# Altium schematic sheet Ethernet Interface.SchDoc (part 1 of 3)
size 594 x 420 mm; Author: ALTIUM GOSTBOM2.0 KEV; SheetNumber: 12; SheetTotal: 48
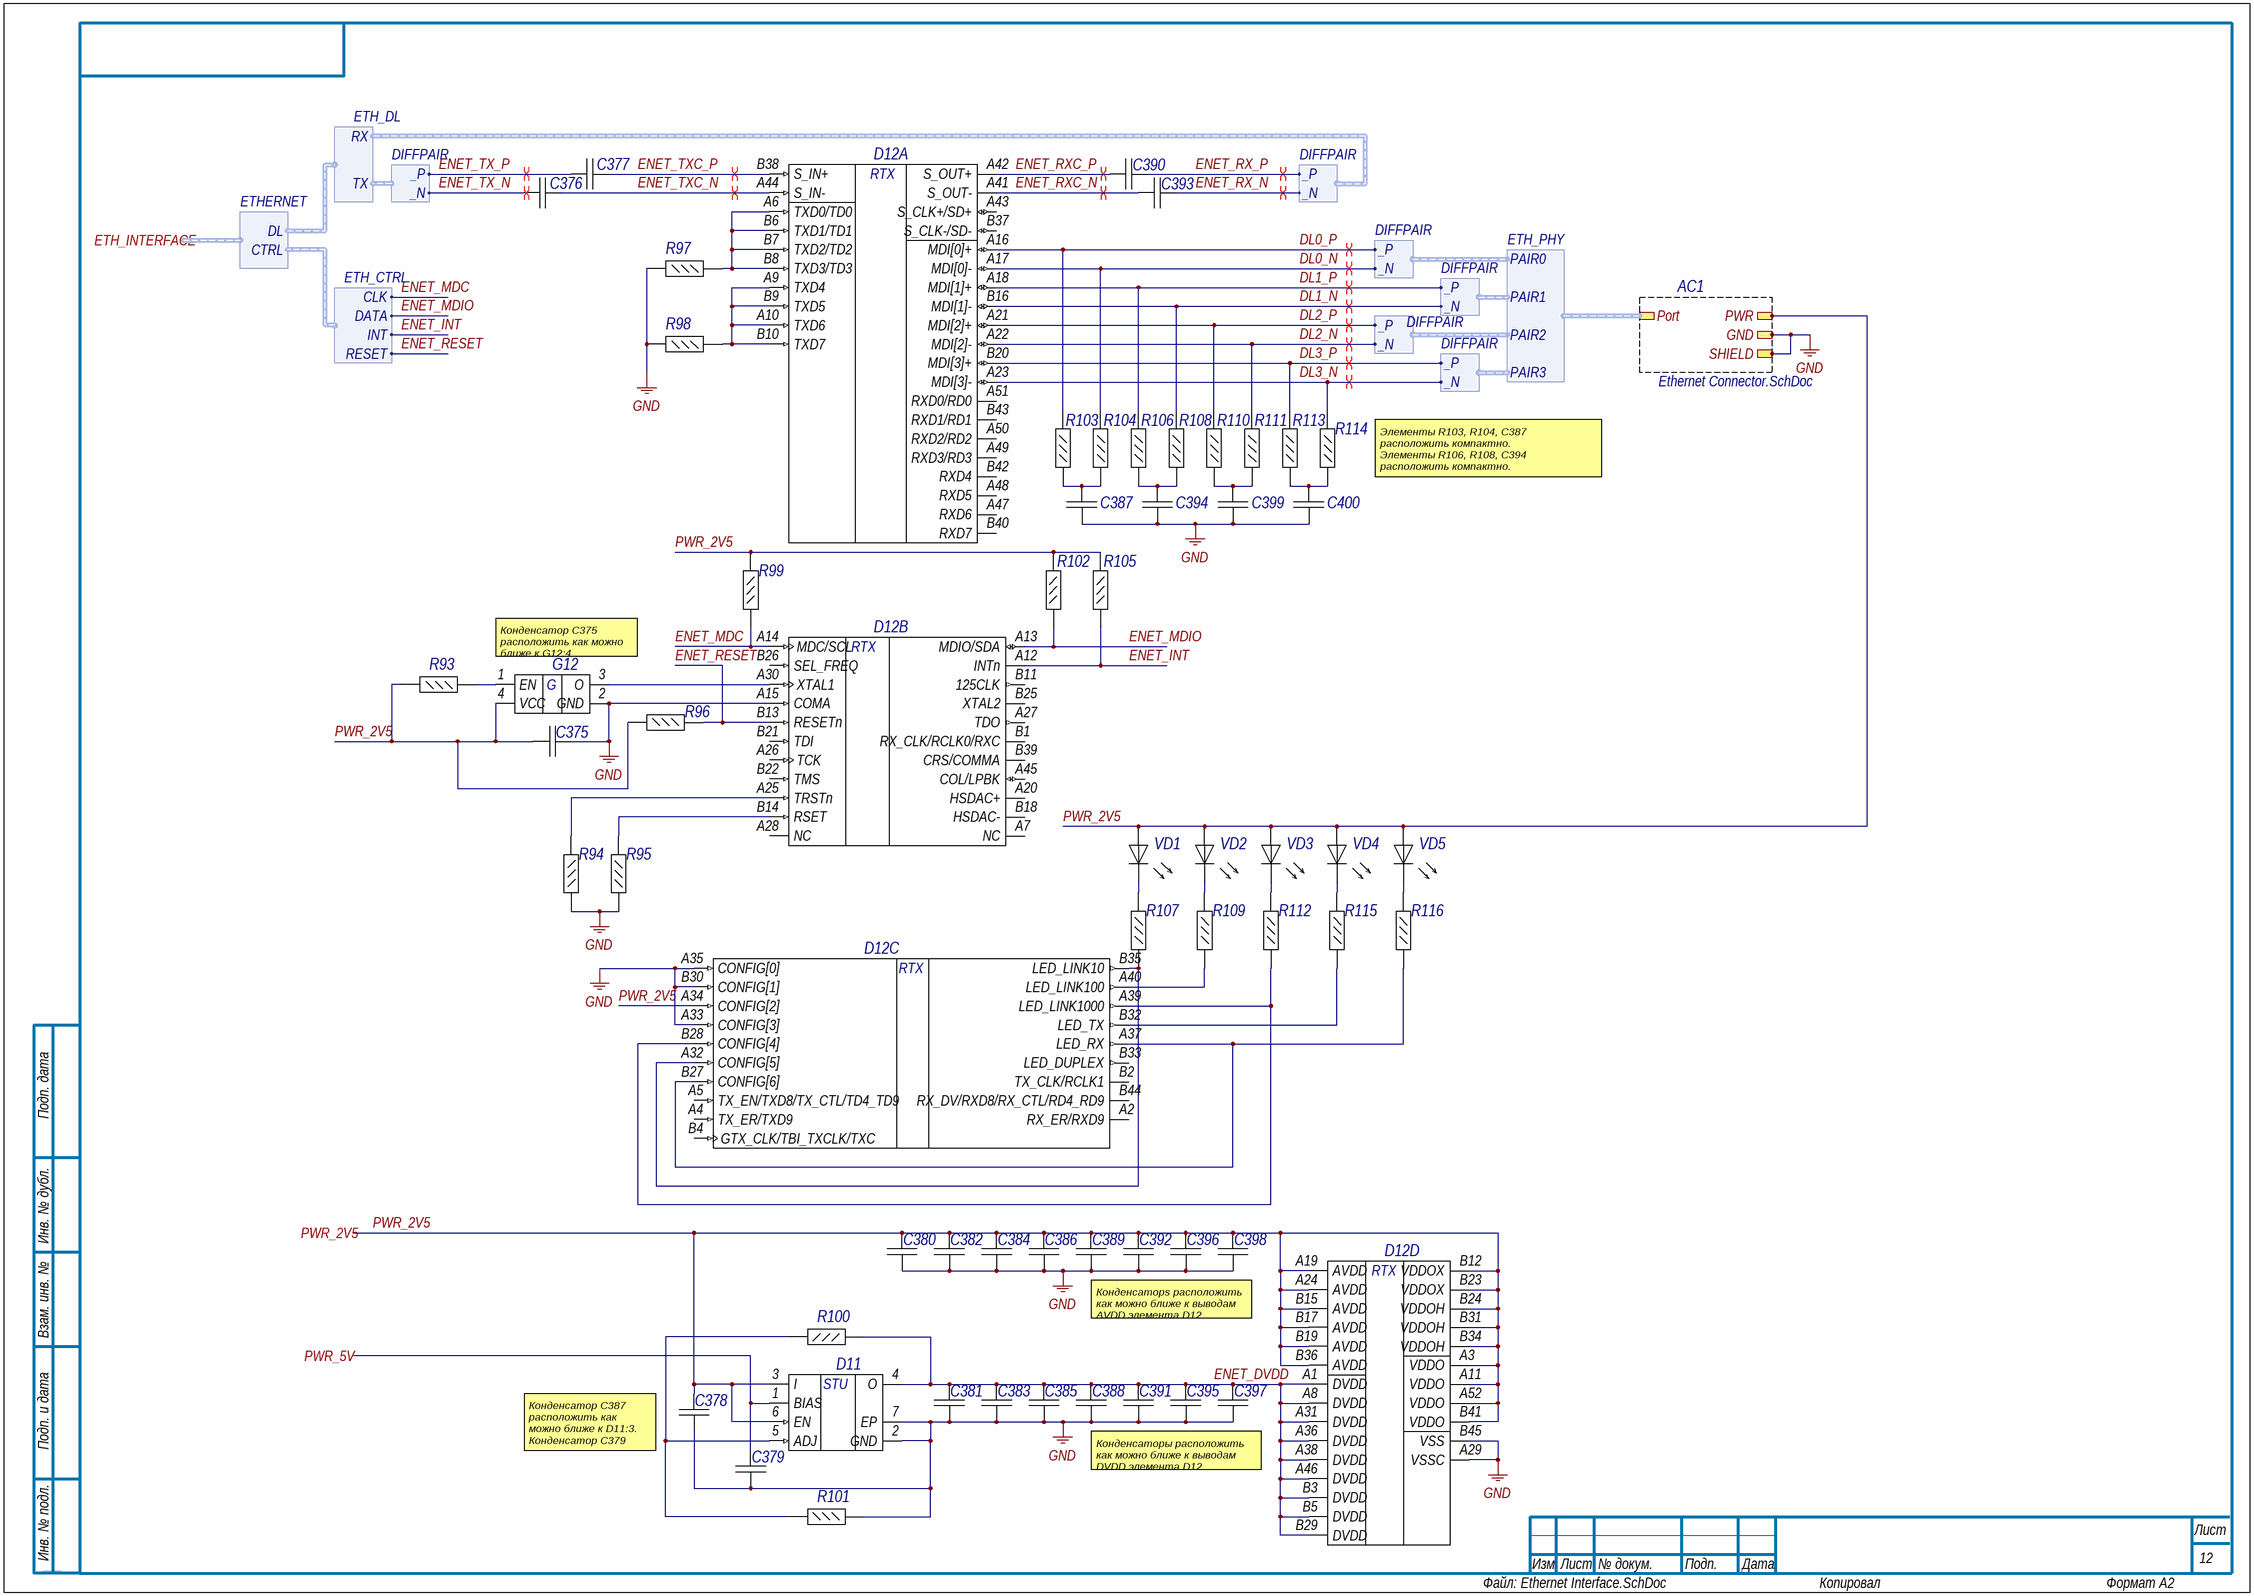
[diagram p0: Ethernet Interface.SchDoc]

## Parts
C375  GRM155R71H103KA88D  [CAPC1005X55X25ML05T10]  (value not drawn)
C376  C1005X7R1E104M  [CAPC1005X55X10LL05]  (value not drawn)
C377  C1005X7R1E104M  [CAPC1005X55X10LL05]  (value not drawn)
C378  C2012X5R1C106K085AC  [CAPC2013X100X20NL20]  (value not drawn)
C379  CGB2A1X5R1E105K033BC  [CAPC1005X33X10LL5]  (value not drawn)
C380  C1005X7R1E104M  [CAPC1005X55X10LL05]  (value not drawn)
C381  GRM31CR61E226KE15L  [CAPC3216X180X55ML20T25]  (value not drawn)
C382  C1005X7R1E104M  [CAPC1005X55X10LL05]  (value not drawn)
C383  GRM188R61A225KE34x  [CAPC1608X90X35ML10T15]  (value not drawn)
C384  C1005X7R1E104M  [CAPC1005X55X10LL05]  (value not drawn)
C385  C1005X7R1E104M  [CAPC1005X55X10LL05]  (value not drawn)
C386  C1005X7R1E104M  [CAPC1005X55X10LL05]  (value not drawn)
C387  GRM155R71H103KA88D  [CAPC1005X55X25ML05T10]  (value not drawn)
C388  C1005X7R1E104M  [CAPC1005X55X10LL05]  (value not drawn)
C389  C1005X7R1E104M  [CAPC1005X55X10LL05]  (value not drawn)
C390  C1005X7R1E104M  [CAPC1005X55X10LL05]  (value not drawn)
C391  C1005X7R1E104M  [CAPC1005X55X10LL05]  (value not drawn)
C392  C1005X7R1E104M  [CAPC1005X55X10LL05]  (value not drawn)
C393  C1005X7R1E104M  [CAPC1005X55X10LL05]  (value not drawn)
C394  GRM155R71H103KA88D  [CAPC1005X55X25ML05T10]  (value not drawn)
C395  C1005X7R1E104M  [CAPC1005X55X10LL05]  (value not drawn)
C396  C1005X7R1E104M  [CAPC1005X55X10LL05]  (value not drawn)
C397  C1005X7R1E104M  [CAPC1005X55X10LL05]  (value not drawn)
C398  C1005X7R1E104M  [CAPC1005X55X10LL05]  (value not drawn)
C399  GRM155R71H103KA88D  [CAPC1005X55X25ML05T10]  (value not drawn)
C400  GRM155R71H103KA88D  [CAPC1005X55X25ML05T10]  (value not drawn)
D11  LTC3025EDC-1#PBF  [LT-DC6-6_V]  (value not drawn)
D12  88E1111-B2-NDC2C000  [MARV-NDC96]  (value not drawn)  (parts A,B,C,D of 4)
G12  SG-310SDF 25.0000M-B3  [EPSON-SG-310-4_V]  (value not drawn)
R93  ERJ-2RKF1002X  [RESC1005X40X25LL05T05]  (value not drawn)
R94  ERJ-2RKF4701X  [RESC1005X40X25LL05T05]  (value not drawn)
R95  ERJ-2RKF4991X  [RESC1005X40X25LL05T05]  (value not drawn)
R96  ERJ-2RKF4701X  [RESC1005X40X25LL05T05]  (value not drawn)
R97  ERJ-2GE0R00X  [RESC1005X40X25LL05T05]  (value not drawn)
R98  ERJ-2GE0R00X  [RESC1005X40X25LL05T05]  (value not drawn)
R99  ERJ-2RKF4701X  [RESC1005X40X25LL05T05]  (value not drawn)
R100  ERJ-2RKF1502X  [RESC1005X40X25LL05T05]  (value not drawn)
R101  ERJ-2RKF1002X  [RESC1005X40X25LL05T05]  (value not drawn)
R102  NRC04F49R9TRF  [RESC1005X35X25NL8T10]  (value not drawn)
R103  NRC04F49R9TRF  [RESC1005X35X25NL8T10]  (value not drawn)
R104  NRC04F49R9TRF  [RESC1005X35X25NL8T10]  (value not drawn)
R105  ERJ-2RKF4701X  [RESC1005X40X25LL05T05]  (value not drawn)
R106  NRC04F49R9TRF  [RESC1005X35X25NL8T10]  (value not drawn)
R107  ERJ-2RKF2400X  [RESC1005X40X25LL05T05]  (value not drawn)
R108  NRC04F49R9TRF  [RESC1005X35X25NL8T10]  (value not drawn)
R109  ERJ-2RKF2400X  [RESC1005X40X25LL05T05]  (value not drawn)
R110  NRC04F49R9TRF  [RESC1005X35X25NL8T10]  (value not drawn)
R111  NRC04F49R9TRF  [RESC1005X35X25NL8T10]  (value not drawn)
R112  ERJ-2RKF2400X  [RESC1005X40X25LL05T05]  (value not drawn)
R113  NRC04F49R9TRF  [RESC1005X35X25NL8T10]  (value not drawn)
R114  NRC04F49R9TRF  [RESC1005X35X25NL8T10]  (value not drawn)
R115  ERJ-2RKF2400X  [RESC1005X40X25LL05T05]  (value not drawn)
R116  ERJ-2RKF2400X  [RESC1005X40X25LL05T05]  (value not drawn)
VD1  150060VS75000  [0603_A]  (value not drawn)
VD2  150060VS75000  [0603_A]  (value not drawn)
VD3  150060VS75000  [0603_A]  (value not drawn)
VD4  150060VS75000  [0603_A]  (value not drawn)
VD5  150060VS75000  [0603_A]  (value not drawn)

## Sub-sheets
AC1 = Ethernet Connector.SchDoc: GND, PWR, Port (harness ETH_PHY), SHIELD

## Ports
ETH_INTERFACE (harness ETHERNET), PWR_2V5, PWR_5V

## Harnesses
DIFFPAIR: _P, _N
ETH_DL: RX, TX
ETH_PHY: PAIR0, PAIR1, PAIR2, PAIR3
ETH_CTRL: DATA, CLK, INT, RESET
ETHERNET: DL, CTRL

## Nets
GND: C375.1 C378.1 C379.1 C380.1 C381.1 C382.1 C383.1 C384.1 C385.1 C386.1 C387.2 C388.1 C389.1 C391.1 C392.1 C394.2 C395.1 C396.1 C397.1 C398.1 C399.2 C400.2 D11.2(GND) D11.7(EP) D12.A15(COMA) D12.A29(VSSC) D12.A33(CONFIG[3]) D12.A35(CONFIG[0]) D12.B30(CONFIG[1]) D12.B45(VSS) G12.2(GND) R94.2 R95.2 R97.1 R98.1 R101.1 ; sheet AC1/GND, sheet AC1/SHIELD
DL0_N: D12.A17(MDI[0]-) R104.1 ; harness DIFFPAIR._N
DL0_P: D12.A16(MDI[0]+) R103.1 ; harness DIFFPAIR._P
DL1_N: D12.B16(MDI[1]-) R108.1 ; harness DIFFPAIR._N
DL1_P: D12.A18(MDI[1]+) R106.1 ; harness DIFFPAIR._P
DL2_N: D12.A22(MDI[2]-) R111.1 ; harness DIFFPAIR._N
DL2_P: D12.A21(MDI[2]+) R110.1 ; harness DIFFPAIR._P
DL3_N: D12.A23(MDI[3]-) R114.1 ; harness DIFFPAIR._N
DL3_P: D12.B20(MDI[3]+) R113.1 ; harness DIFFPAIR._P
ENET_DVDD: C381.2 C383.2 C385.2 C388.2 C391.2 C395.2 C397.2 D11.4(O) D12.A1(DVDD) D12.A8(DVDD) D12.A31(DVDD) D12.A36(DVDD) D12.A38(DVDD) D12.A46(DVDD) D12.B3(DVDD) D12.B5(DVDD) D12.B29(DVDD) R100.2
ENET_INT: D12.A12(INTn) R105.1 ; harness ETH_CTRL.INT
ENET_MDC: D12.A14(MDC/SCL) R99.1 ; harness ETH_CTRL.CLK
ENET_MDIO: D12.A13(MDIO/SDA) R102.1 ; harness ETH_CTRL.DATA
ENET_RESET: D12.B13(RESETn) R96.1 ; harness ETH_CTRL.RESET
ENET_RX_N: C393.1 ; harness DIFFPAIR._N
ENET_RX_P: C390.1 ; harness DIFFPAIR._P
ENET_RXC_N: C393.2 D12.A41(S_OUT-)
ENET_RXC_P: C390.2 D12.A42(S_OUT+)
ENET_TX_N: C376.1 ; harness DIFFPAIR._N
ENET_TX_P: C377.1 ; harness DIFFPAIR._P
ENET_TXC_N: C376.2 D12.A44(S_IN-)
ENET_TXC_P: C377.2 D12.B38(S_IN+)
PWR_2V5: C375.2 C378.2 C380.2 C382.2 C384.2 C386.2 C389.2 C392.2 C396.2 C398.2 D11.3(I) D11.6(EN) D12.A3(VDDO) D12.A11(VDDO) D12.A19(AVDD) D12.A24(AVDD) D12.A34(CONFIG[2]) D12.A52(VDDO) D12.B12(VDDOX) D12.B15(AVDD) D12.B17(AVDD) D12.B19(AVDD) D12.B23(VDDOX) D12.B24(VDDOH) D12.B31(VDDOH) D12.B34(VDDOH) D12.B36(AVDD) D12.B41(VDDO) G12.4(VCC) R93.1 R96.2 R99.2 R102.2 R105.2 VD1.2(A) VD2.2(A) VD3.2(A) VD4.2(A) VD5.2(A) ; port PWR_2V5, sheet AC1/PWR
PWR_5V: C379.2 D11.1(BIAS) ; port PWR_5V
NetC387_1: C387.1 R103.2 R104.2
NetC394_1: C394.1 R106.2 R108.2
NetC399_1: C399.1 R110.2 R111.2
NetC400_1: C400.1 R113.2 R114.2
NetD11_5: D11.5(ADJ) R100.1 R101.2
NetD12_A6: D12.A6(TXD0/TD0) D12.B6(TXD1/TD1) D12.B7(TXD2/TD2) D12.B8(TXD3/TD3) R97.2
NetD12_A9: D12.A9(TXD4) D12.A10(TXD6) D12.B9(TXD5) D12.B10(TXD7) R98.2
NetD12_A25: D12.A25(TRSTn) R94.1
NetD12_A30: D12.A30(XTAL1) G12.3(O)
NetD12_A32: D12.A32(CONFIG[5]) D12.B35(LED_LINK10) R107.2
NetD12_A37: D12.A37(LED_RX) D12.B27(CONFIG[6]) R116.2
NetD12_A39: D12.A39(LED_LINK1000) D12.B28(CONFIG[4]) R112.2
NetD12_A40: D12.A40(LED_LINK100) R109.2
NetD12_B14: D12.B14(RSET) R95.1
NetD12_B32: D12.B32(LED_TX) R115.2
NetG12_1: G12.1(EN) R93.2
NetR107_1: R107.1 VD1.1(K)
NetR109_1: R109.1 VD2.1(K)
NetR112_1: R112.1 VD3.1(K)
NetR115_1: R115.1 VD4.1(K)
NetR116_1: R116.1 VD5.1(K)

Not connected (* = marked no-connect by the designer): D12 A2(RX_ER/RXD9) A4(TX_ER/TXD9) A5(TX_EN/TXD8/TX_CTL/TD4_TD9) A7(NC) A20(HSDAC+) A26(TCK) A27(TDO) A28(NC) A43(S_CLK+/SD+) A45(COL/LPBK) A47(RXD6) A48(RXD5) A49(RXD3/RD3) A50(RXD2/RD2) A51(RXD0/RD0) B1(RX_CLK/RCLK0/RXC) B2(TX_CLK/RCLK1) B4(GTX_CLK/TBI_TXCLK/TXC) B11(125CLK) B18(HSDAC-) B21(TDI) B22(TMS) B25(XTAL2) B26(SEL_FREQ) B33(LED_DUPLEX) B37(S_CLK-/SD-) B39(CRS/COMMA) B40(RXD7) B42(RXD4) B43(RXD1/RD1) B44(RX_DV/RXD8/RX_CTL/RD4_RD9)

## Layout directives
differential pair: DL0_N, DL0_P, DL1_N, DL1_P, DL2_N, DL2_P, DL3_N, DL3_P, ENET_RX_N, ENET_RX_P, ENET_RXC_N, ENET_RXC_P, ENET_TX_N, ENET_TX_P, ENET_TXC_N, ENET_TXC_P

## Notes on the sheet
- Элементы R103, R104, C387 расположить компактно.
  Элементы R106, R108, C394 расположить компактно.
  Элементы R110, R111, C399 расположить компактно.
  Элементы R113, R114, C400 расположить компактно.
- (near G12) Конденсатор C375 расположить как можно ближе к G12:4.
- Конденсаторs расположить как можно ближе к выводам AVDD элемента D12.
- (near C378) Конденсатор C387 расположить как можно ближе к D11:3.
  Конденсатор C379 расположить как можно ближе к D11:1.
- Конденсаторы расположить как можно ближе к выводам DVDD элемента D12.
- Подп. дата
- Инв. № дубл.
- Взам. инв. №
- Подп. и дата
- Инв. № подл.
- Изм.
- Лист
- № докум.
- Подп.
- Дата
- ALTIUM GOSTBOM2.0 KEV
- Файл:
- Копировал
- Формат А2
- (in symbol E116, part A) RTX
- (in symbol E116, part B) RTX
- (in symbol E116, part C) RTX
- (in symbol E116, part D) RTX
- (in symbol E117) G
- (in symbol E118) STU